# EAGLE design R141D (EAGLE 6.6.0)
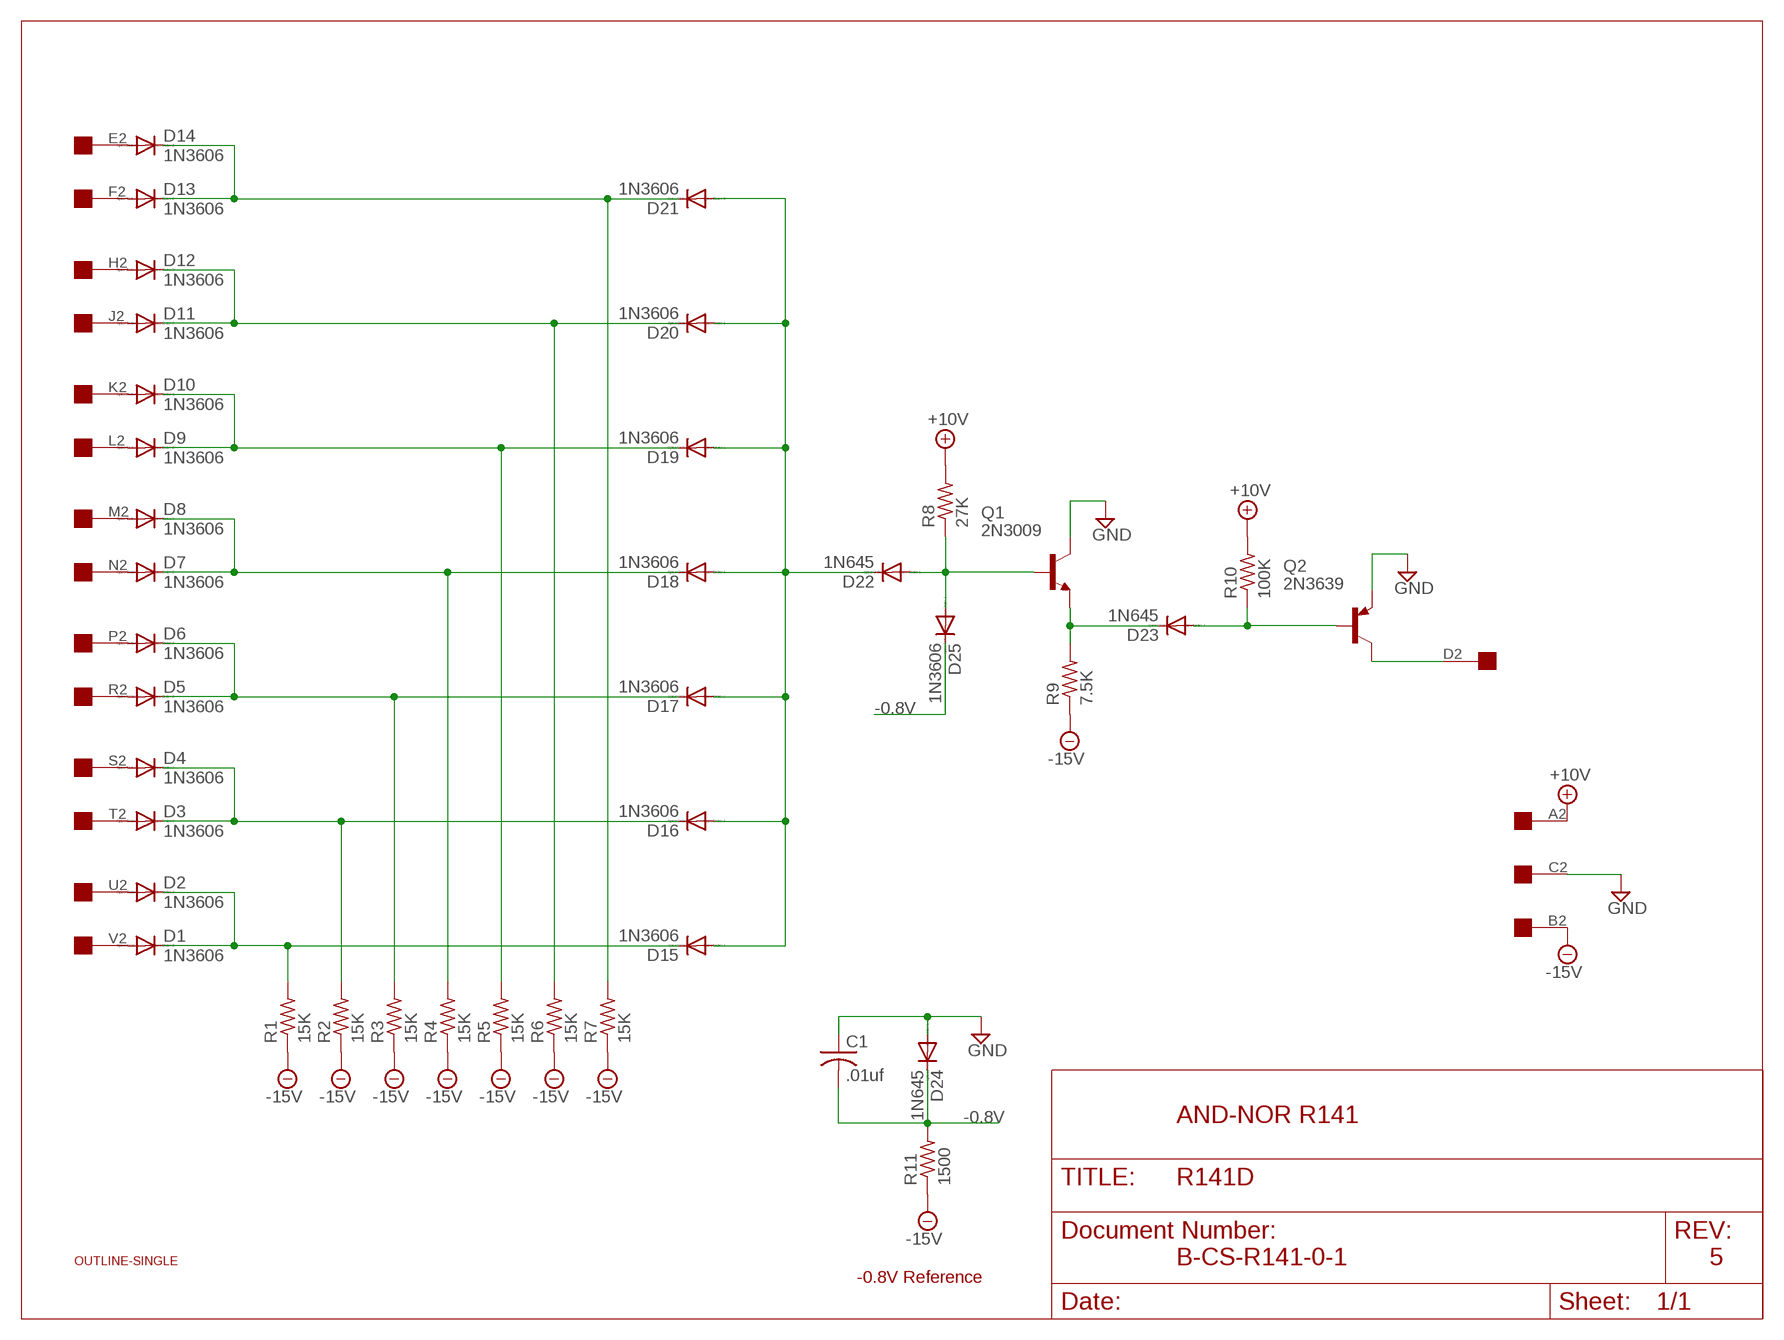
[diagram p0: schematic, sheet 1]

## Parts
C1  .01uf  C-US  [C063-025X075]
D1  1N3606  1N4148DO35-10  [DO35-10]
D2  1N3606  1N4148DO35-10  [DO35-10]
D3  1N3606  1N4148DO35-10  [DO35-10]
D4  1N3606  1N4148DO35-10  [DO35-10]
D5  1N3606  1N4148DO35-10  [DO35-10]
D6  1N3606  1N4148DO35-10  [DO35-10]
D7  1N3606  1N4148DO35-10  [DO35-10]
D8  1N3606  1N4148DO35-10  [DO35-10]
D9  1N3606  1N4148DO35-10  [DO35-10]
D10  1N3606  1N4148DO35-10  [DO35-10]
D11  1N3606  1N4148DO35-10  [DO35-10]
D12  1N3606  1N4148DO35-10  [DO35-10]
D13  1N3606  1N4148DO35-10  [DO35-10]
D14  1N3606  1N4148DO35-10  [DO35-10]
D15  1N3606  1N4148DO35-10  [DO35-10]
D16  1N3606  1N4148DO35-10  [DO35-10]
D17  1N3606  1N4148DO35-10  [DO35-10]
D18  1N3606  1N4148DO35-10  [DO35-10]
D19  1N3606  1N4148DO35-10  [DO35-10]
D20  1N3606  1N4148DO35-10  [DO35-10]
D21  1N3606  1N4148DO35-10  [DO35-10]
D22  1N645  1N4148DO35-10  [DO35-10]
D23  1N645  1N4148DO35-10  [DO35-10]
D24  1N645  1N4148DO35-10  [DO35-10]
D25  1N3606  1N4148DO35-10  [DO35-10]
Q1  2N3009  2N3019-NPN-TO39-EBC  [TO39]
Q2  2N3639  2N3637  [TO39]
R1  15K  R-US_0207/10  [0207/10]
R2  15K  R-US_0207/10  [0207/10]
R3  15K  R-US_0207/10  [0207/10]
R4  15K  R-US_0207/10  [0207/10]
R5  15K  R-US_0207/10  [0207/10]
R6  15K  R-US_0207/10  [0207/10]
R7  15K  R-US_0207/10  [0207/10]
R8  27K  R-US_0207/10  [0207/10]
R9  7.5K  R-US_0207/10  [0207/10]
R10  100K  R-US_0207/10  [0207/10]
R11  1500  R-US_0207/10  [0207/10]
U$1  OUTLINE-SINGLE  [SINGLE]
U$2  EDGE-1  [EDGE-CON1]

## Nets
+10V [Power]: R8.2 R10.2 U$2.A2
-0.8V [Power]: C1.2 D24.C D25.C R11.2
-15V [Power]: R1.1 R2.1 R3.1 R4.1 R5.1 R6.1 R7.1 R9.1 R11.1 U$2.B2
GND [Power]: C1.1 D24.A Q1.3(C) Q2.1(E) U$2.C2
N$1: D4.A U$2.S2
N$2: D23.A Q2.2(B) R10.1
N$3: D22.A D25.A Q1.2(B) R8.1
N$4: Q2.3(C) U$2.D2
N$5: D11.A U$2.J2
N$6: D11.C D12.C D20.C R6.2
N$7: D10.A U$2.K2
N$8: D2.A U$2.U2
N$9: D8.A U$2.M2
N$10: D9.A U$2.L2
N$11: D9.C D10.C D19.C R5.2
N$12: D6.A U$2.P2
N$13: D23.C Q1.1(E) R9.2
N$14: D1.A U$2.V2
N$15: D15.A D16.A D17.A D18.A D19.A D20.A D21.A D22.C
N$17: D1.C D2.C D15.C R1.2
N$20: D14.A U$2.E2
N$21: D13.A U$2.F2
N$22: D13.C D14.C D21.C R7.2
N$23: D12.A U$2.H2
N$26: D7.A U$2.N2
N$27: D7.C D8.C D18.C R4.2
N$31: D5.A U$2.R2
N$32: D5.C D6.C D17.C R3.2
N$36: D3.A U$2.T2
N$37: D3.C D4.C D16.C R2.2

## Notes on the sheet
- AND-NOR R141
- B-CS-R141-0-1 | 5
- -0.8V Reference

## Library data of the parts
C1 = dec-con:C-US: Capacitors with funky DEC lead spacing.
D1-D25 = diode:1N4148: DIODE high speed (Philips)
Q1 = transistor:*-NPN-: NPN Transistror BF959 corrected 2008.03.06
Q2 = transistor-pnp:2N3637*: PNP Transistror
R1-R11 = rcl:R-US_: RESISTOR, American symbol
U$1 = dec-con:OUTLINE-*: Board outlines for DEC boards.
U$2 = dec-con:EDGE-1: Single-Sided DEC Edge Connector -- (side 2)

## Net classes
1 Power: width 0.813 mm

## Board
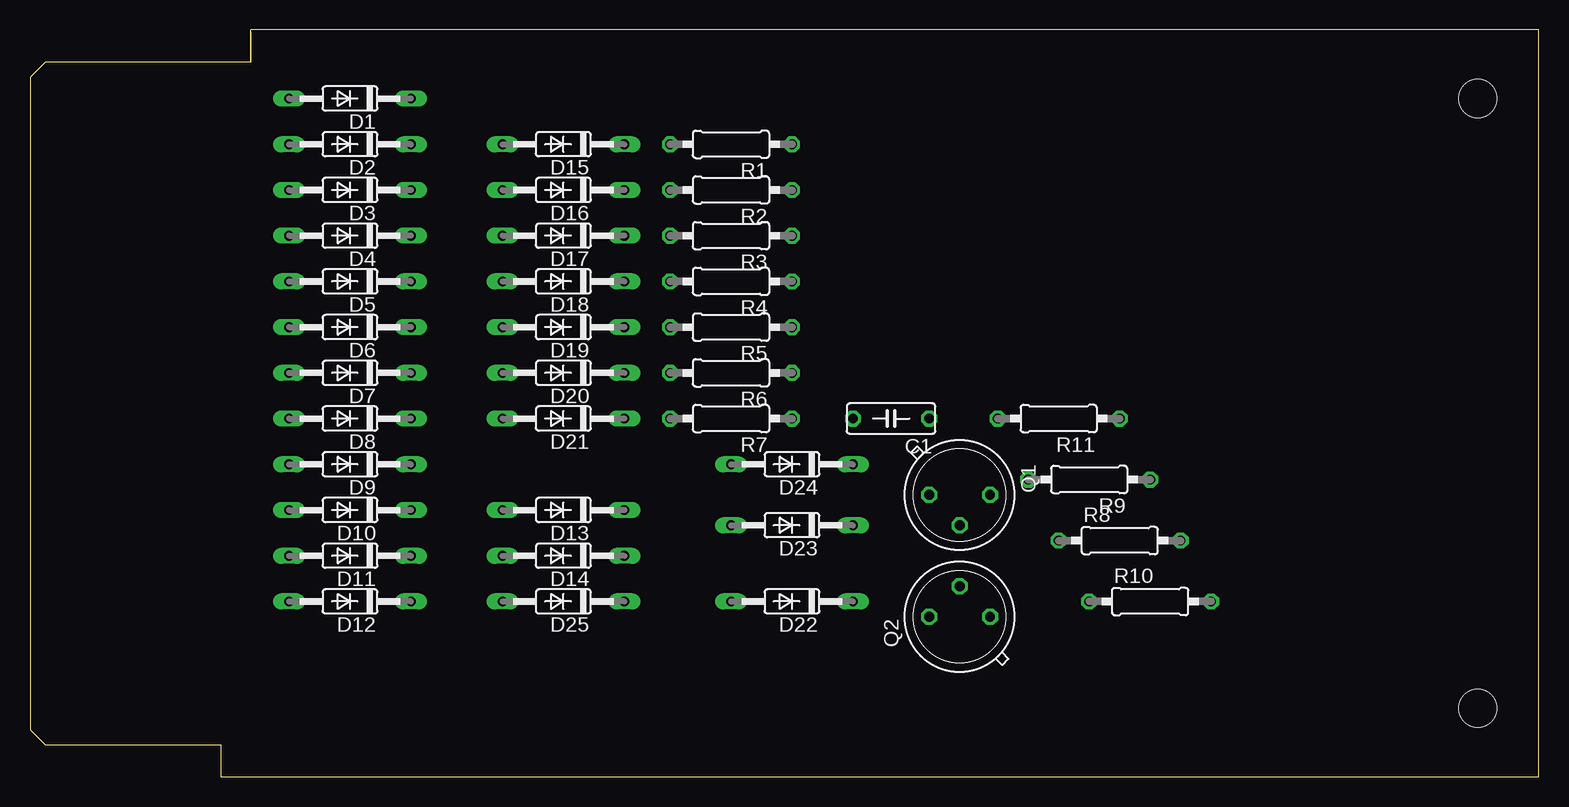
[diagram p1: board, top side]
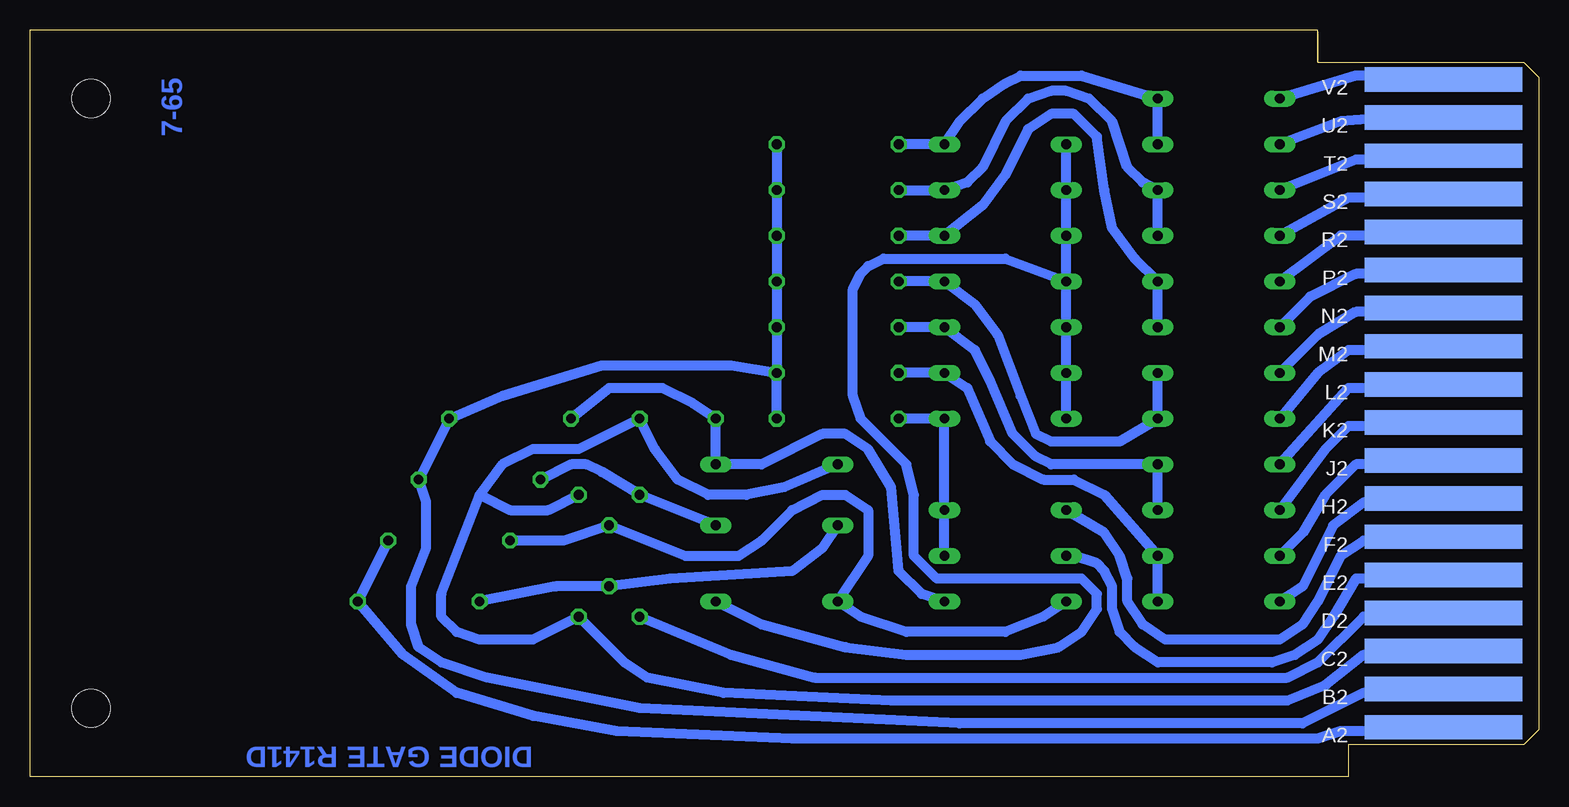
[diagram p2: board, bottom side, seen from below]

Size 125.73 x 62.23 mm. Coordinates in mm from the lower left corner, seen from the top.
Copper layers (1+16): Top 0.035mm / dielectric 1.5mm / Bottom 0.035mm
Design rules "16mils": minimum track width 16mil, minimum drill 32mil, track to track 15mil, track to pad 10mil, pad to pad 10mil, via to via 10mil, smd to smd 10mil, copper to edge 13mil, drill to drill 10mil, minimum pad ring 10mil, minimum via ring 8mil, stop-mask expansion 0mil, vias tented up to drill 0mil, thermal gap 10mil

### Footprints (pad centres in the part's own frame; a part is rotated, then mirrored left to right if it is on the bottom)
C063-025X075 = drill 0.813 octagon: 1 -2.54,0; 2 3.81,0
DO35-10 = drill 0.813 long: A 5.08,0; C -5.08,0
TO39 = drill 0.813 octagon: 1 0,-2.54; 2 2.54,0; 3 0,2.54
0207/10 = drill 0.813 octagon: 1 -5.08,0; 2 5.08,0
SINGLE = hole 3.175: 120.65,56.515; 120.65,5.715
EDGE-CON1 = smd 13.106 x 2.032 bottom: A2 7.938,4.128; B2 7.938,7.303; C2 7.938,10.477; D2 7.938,13.652; E2 7.938,16.828; F2 7.938,20.003; H2 7.938,23.177; J2 7.938,26.352; K2 7.938,29.527; L2 7.938,32.703; M2 7.938,35.877; N2 7.938,39.053; P2 7.938,42.227; R2 7.938,45.403; S2 7.938,48.578; T2 7.938,51.752; U2 7.938,54.928; V2 7.938,58.102

### Placement (x,y rotation side)
C1  72.39,29.84 180 top
D1  26.67,56.52 180 top
D2  26.67,52.7 180 top
D3  26.67,48.9 180 top
D4  26.67,45.09 180 top
D5  26.67,41.27 180 top
D6  26.67,37.47 180 top
D7  26.67,33.66 180 top
D8  26.67,29.84 180 top
D9  26.67,26.04 180 top
D10  26.67,22.23 180 top
D11  26.67,18.41 180 top
D12  26.67,14.61 180 top
D13  44.45,22.23 180 top
D14  44.45,18.41 180 top
D15  44.45,52.7 180 top
D16  44.45,48.9 180 top
D17  44.45,45.09 180 top
D18  44.45,41.27 180 top
D19  44.45,37.47 180 top
D20  44.45,33.66 180 top
D21  44.45,29.84 180 top
D22  63.5,14.61 180 top
D23  63.5,20.95 180 top
D24  63.5,26.04 180 top
D25  44.45,14.61 180 top
Q1  77.47,23.5 270 top
Q2  77.47,13.34 90 top
R1  58.42,52.7 180 top
R2  58.42,48.9 180 top
R3  58.42,45.09 180 top
R4  58.42,41.27 180 top
R5  58.42,37.47 180 top
R6  58.42,33.66 180 top
R7  58.42,29.84 180 top
R8  90.81,19.68 0 top
R9  88.27,24.77 180 top
R10  93.35,14.61 0 top
R11  85.73,29.84 180 top
U$1  0,0 0 top
U$2  0,0 0 top

### Tracks (layer width: path | path; a pad name or v marks a point on that pad's centre or on a via)
+10V
  Bottom 0.813: U$2.A2 8.89,3.81 16.51,3.81 18.42,3.17 62.23,3.17 76.84,3.81 83.82,5.08 90.17,6.99 94.62,10.16 R10.2 R8.2
-0.8V
  Bottom 0.813: R11.2 77.47,32.38 73.03,32.38 70.49,31.11 C1.2 D24.C 64.77,26.04 59.69,28.57 57.79,28.57 55.88,27.3 53.98,24.13 53.34,17.14 51.44,15.24 D25.C
-15V
  Bottom 0.813: U$2.B2 8.89,6.99 14.61,6.99 19.69,4.45 48.26,4.45 74.93,5.71 87.63,8.26 91.44,9.53 93.35,10.79 93.98,12.7 93.98,15.88 92.71,19.05 92.71,22.86 R9.1 R11.1 86.36,31.75 78.11,34.29 67.31,34.29 R6.1 | R1.1 R2.1 R3.1 R4.1 R5.1 R6.1 | R7.1 R6.1
GND
  Bottom 0.813: 88.27,23.5 86.36,26.04 83.82,27.3 80.01,27.3 C1.1 73.66,27.3 71.76,24.77 69.22,23.5 66.04,23.5 62.87,24.13 D24.A | 88.27,23.5 85.73,22.23 82.55,22.23 Q1.3 | 88.27,23.5 91.44,15.24 91.44,13.34 90.17,12.06 88.27,11.43 83.82,11.43 Q2.1 76.2,9.53 74.3,8.26 67.95,6.99 53.98,6.35 20.96,6.35 17.78,7.62 14.61,10.16 8.89,10.16 U$2.C2
N$1
  Bottom 0.813: U$2.S2 8.89,48.26 15.88,48.26 D4.A
N$2
  Bottom 0.813: R10.1 81.92,15.88 Q2.2 72.39,16.51 62.23,17.14 59.69,19.05 D23.A
N$3
  Bottom 0.813: R8.1 81.28,19.68 Q1.2 71.12,18.41 66.68,18.41 64.77,19.68 62.23,22.23 59.69,23.5 57.79,23.5 55.88,22.23 55.88,18.41 D22.A 56.52,13.34 52.71,12.06 44.45,12.06 41.28,13.34 D25.A
N$4
  Bottom 0.813: Q2.3 67.31,10.16 60.33,8.26 20.96,8.26 18.42,9.53 14.61,13.34 8.89,13.34 U$2.D2
N$5
  Bottom 0.813: U$2.J2 8.89,26.04 15.24,26.04 17.78,23.5 19.69,20.32 D11.A
N$6
  Bottom 0.813: D12.C D11.C 36.2,23.5 38.74,24.77 41.28,24.77 43.82,26.04 45.72,27.94 47.63,32.38 D20.C R6.2
N$7
  Bottom 0.813: U$2.K2 8.89,29.21 15.88,29.21 17.78,27.3 D10.A
N$8
  Bottom 0.813: U$2.U2 8.26,55.24 16.51,54.61 D2.A
N$9
  Bottom 0.813: U$2.M2 9.53,35.56 15.88,35.56 18.42,33.66 D8.A
N$10
  Bottom 0.813: U$2.L2 8.89,32.38 15.88,32.38 D9.A
N$11
  Bottom 0.813: D10.C D9.C 40.64,26.04 41.91,26.67 43.82,28.57 45.72,33.02 46.99,35.56 D19.C R5.2
N$12
  Bottom 0.813: U$2.P2 8.89,41.91 15.24,41.91 19.05,40.01 D6.A
N$13
  Bottom 0.813: D23.C Q1.1 78.11,25.4 79.38,26.04 80.65,26.04 R9.2
N$14
  Bottom 0.813: U$2.V2 8.89,58.42 15.24,58.42 D1.A
N$15
  Bottom 0.813: D22.C 64.77,12.7 57.79,10.79 52.71,10.16 43.18,10.16 40.01,10.79 38.1,12.06 36.83,13.97 36.83,15.24 38.1,16.51 50.17,16.51 52.07,18.41 52.07,23.5 52.71,26.04 56.52,29.84 57.15,31.75 57.15,40.64 56.52,41.91 55.88,42.55 54.61,43.18 44.45,43.18 D18.A | D21.A D20.A D19.A D18.A | D18.A D17.A D16.A D15.A
N$17
  Bottom 0.813: D2.C D1.C 38.1,58.42 43.18,58.42 44.45,57.78 46.36,56.52 48.26,54.61 D15.C R1.2
N$20
  Bottom 0.813: U$2.E2 8.89,16.51 15.24,16.51 17.15,13.34 18.42,11.43 20.32,10.16 22.23,9.53 31.75,9.53 33.66,10.79 34.93,12.06 35.56,13.97 35.56,15.88 36.2,17.14 36.83,17.78 38.74,18.41 D14.A
N$21
  Bottom 0.813: U$2.F2 7.62,19.68 14.61,19.68 16.51,18.41 18.42,14.61 19.69,12.7 21.59,11.43 31.12,11.43 33.02,12.7 34.29,14.61 34.29,16.51 34.93,18.41 36.2,20.32 D13.A
N$22
  Bottom 0.813: D14.C D13.C D21.C R7.2
N$23
  Bottom 0.813: U$2.H2 8.89,22.86 14.61,22.86 17.15,20.95 19.69,15.88 D12.A
N$26
  Bottom 0.813: U$2.N2 9.53,38.73 15.24,38.73 18.42,36.83 D7.A
N$27
  Bottom 0.813: D7.C D8.C 34.93,27.94 40.64,27.94 41.91,28.57 43.18,31.75 45.09,36.83 46.99,39.37 D18.C R4.2
N$31
  Bottom 0.813: U$2.R2 8.89,45.09 16.51,45.09 D5.A
N$32
  Bottom 0.813: D6.C D5.C 33.66,43.18 35.56,45.72 36.2,48.9 36.83,53.34 38.74,55.24 40.64,55.24 42.55,53.98 44.45,50.16 46.36,47.62 D17.C R3.2
N$36
  Bottom 0.813: U$2.T2 8.26,51.44 15.24,51.44 D3.A
N$37
  Bottom 0.813: D4.C D3.C 33.02,49.53 34.29,50.8 35.56,54.61 37.47,56.52 39.37,57.15 40.64,57.15 42.55,56.52 44.45,54.61 46.36,50.8 47.63,49.53 D16.C R2.2

### Text on the board
Bottom: 7-65 | DIODE GATE R141D